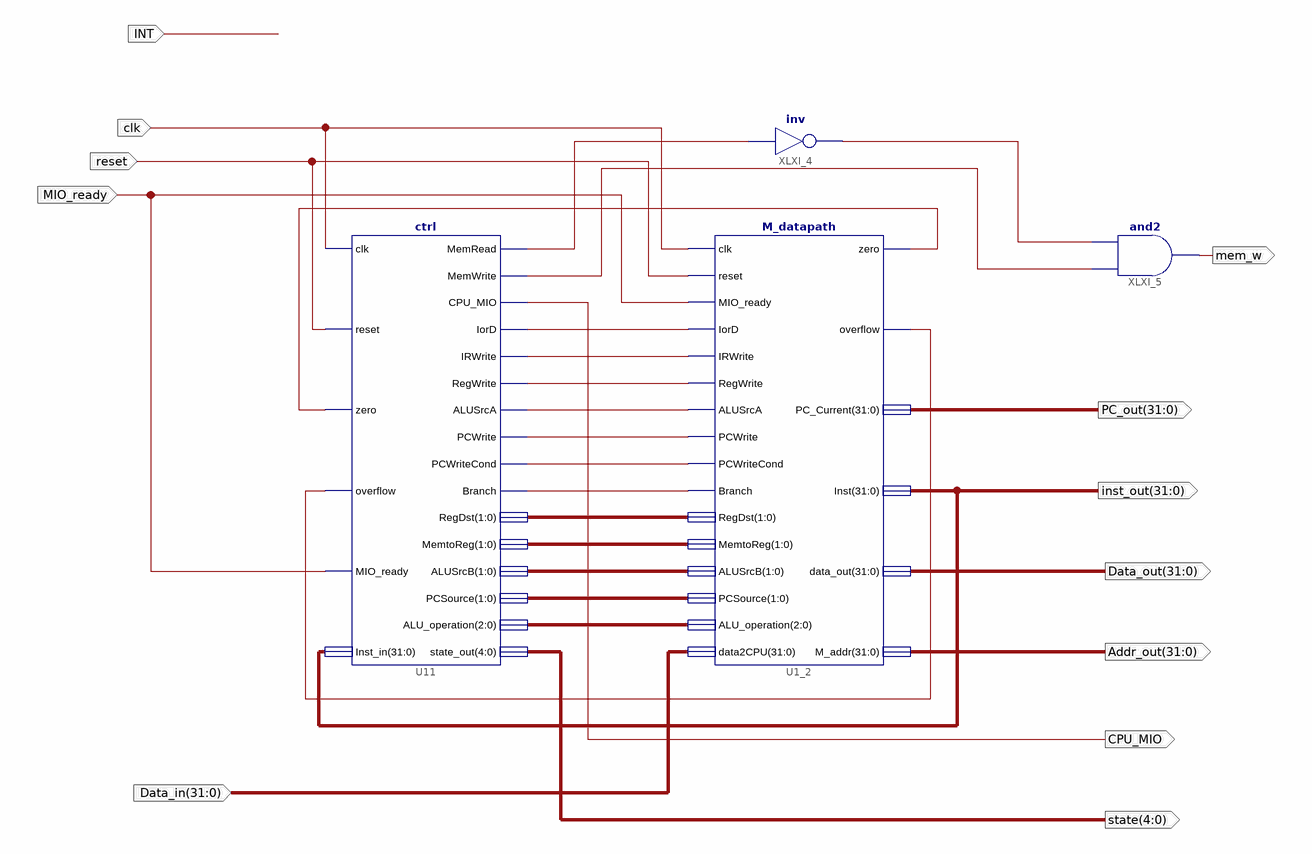
[diagram p0: schematic sheet 1]
// Xilinx ISE schematic Multi_CPU.sch (kintex7) as structural Verilog: 4 symbols, 12 ports
module Multi_CPU (
  input  [31:0] Data_in,
  input  INT,
  input  clk,
  input  reset,
  input  MIO_ready,
  output CPU_MIO,
  output mem_w,
  output [4:0] state,
  output [31:0] PC_out,
  output [31:0] inst_out,
  output [31:0] Data_out,
  output [31:0] Addr_out
);

  wire XLXN_6, XLXN_7, XLXN_8, XLXN_9, XLXN_10, XLXN_11, XLXN_12, XLXN_19, XLXN_20, XLXN_21, XLXN_22, XLXN_27;
  wire [1:0] XLXN_2, XLXN_3, XLXN_4, XLXN_5;
  wire [2:0] XLXN_1;

  M_datapath #(.VeriModel("M_datapath")) U1_2 (
    .clk(clk), .reset(reset), .MIO_ready(MIO_ready), .IorD(XLXN_6), .IRWrite(XLXN_7), .RegWrite(XLXN_8),
    .ALUSrcA(XLXN_9), .PCWrite(XLXN_10), .PCWriteCond(XLXN_11), .Branch(XLXN_12), .RegDst(XLXN_5),
    .MemtoReg(XLXN_4), .ALUSrcB(XLXN_3), .PCSource(XLXN_2), .ALU_operation(XLXN_1), .data2CPU(Data_in),
    .zero(XLXN_19), .overflow(XLXN_20), .PC_Current(PC_out), .Inst(inst_out), .data_out(Data_out),
    .M_addr(Addr_out));
  ctrl U11 (
    .clk(clk), .reset(reset), .zero(XLXN_19), .overflow(XLXN_20), .MIO_ready(MIO_ready), .Inst_in(inst_out),
    .MemRead(XLXN_21), .MemWrite(XLXN_22), .CPU_MIO(CPU_MIO), .IorD(XLXN_6), .IRWrite(XLXN_7),
    .RegWrite(XLXN_8), .ALUSrcA(XLXN_9), .PCWrite(XLXN_10), .PCWriteCond(XLXN_11), .Branch(XLXN_12),
    .RegDst(XLXN_5), .MemtoReg(XLXN_4), .ALUSrcB(XLXN_3), .PCSource(XLXN_2), .ALU_operation(XLXN_1),
    .state_out(state));
  not XLXI_4 (XLXN_27, XLXN_21);
  and XLXI_5 (mem_w, XLXN_22, XLXN_27);
endmodule
